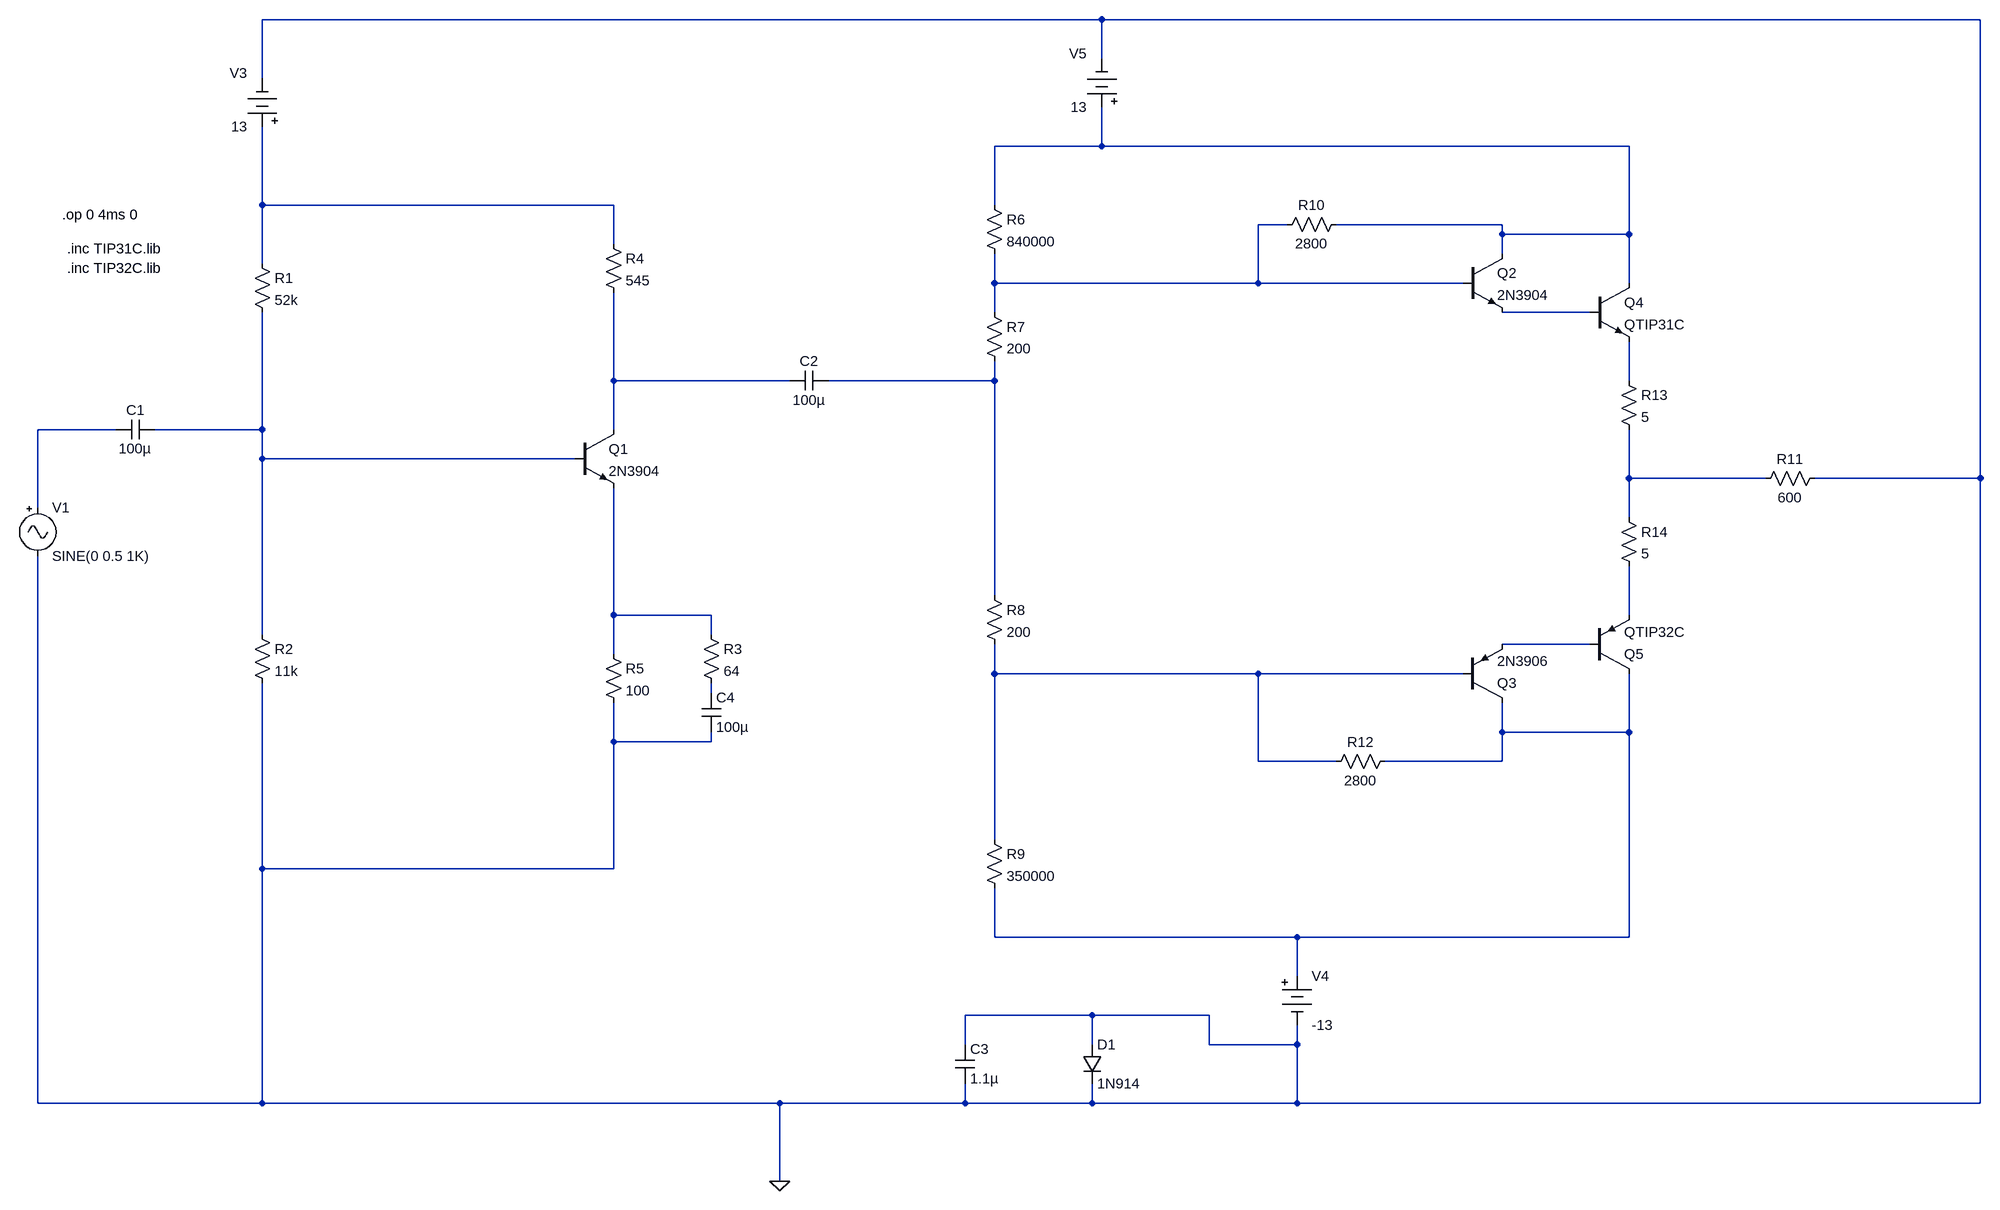
[diagram p0: schematic Scematic_v5_darlington.asc]
Scematic_v5_darlington.asc, the LTspice schematic file:
Version 4
SHEET 1 3092 1264
WIRE 1344 -656 -32 -656
WIRE 2784 -656 1344 -656
WIRE 1344 -592 1344 -656
WIRE -32 -560 -32 -656
WIRE 1344 -448 1344 -512
WIRE 1344 -448 1168 -448
WIRE 2208 -448 1344 -448
WIRE -32 -352 -32 -480
WIRE 544 -352 -32 -352
WIRE 1168 -352 1168 -448
WIRE 1648 -320 1600 -320
WIRE 2000 -320 1728 -320
WIRE 2000 -304 2000 -320
WIRE 2208 -304 2208 -448
WIRE 2208 -304 2000 -304
WIRE 544 -288 544 -352
WIRE 2000 -272 2000 -304
WIRE -32 -256 -32 -352
WIRE 1168 -224 1168 -272
WIRE 1600 -224 1600 -320
WIRE 1600 -224 1168 -224
WIRE 1936 -224 1600 -224
WIRE 2208 -224 2208 -304
WIRE 1168 -176 1168 -224
WIRE 2144 -176 2000 -176
WIRE 544 -128 544 -208
WIRE 544 -64 544 -128
WIRE 704 -64 544 -64
WIRE 832 -64 704 -64
WIRE 1168 -64 1168 -96
WIRE 1168 -64 896 -64
WIRE 2208 -64 2208 -128
WIRE -272 16 -400 16
WIRE -32 16 -32 -176
WIRE -32 16 -208 16
WIRE 544 16 544 -64
WIRE -32 64 -32 16
WIRE 128 64 -32 64
WIRE 480 64 128 64
WIRE 2208 96 2208 16
WIRE 2352 96 2208 96
WIRE 2432 96 2352 96
WIRE 2784 96 2784 -656
WIRE 2784 96 2512 96
WIRE -400 144 -400 16
WIRE 2208 160 2208 96
WIRE 544 208 544 112
WIRE 1168 288 1168 -64
WIRE 544 320 544 208
WIRE 704 320 544 320
WIRE 2208 320 2208 240
WIRE -32 352 -32 64
WIRE 704 352 704 320
WIRE 2144 368 2000 368
WIRE 544 384 544 320
WIRE 1168 416 1168 368
WIRE 1600 416 1168 416
WIRE 1936 416 1600 416
WIRE 704 448 704 432
WIRE 2000 512 2000 464
WIRE 2208 512 2208 416
WIRE 2208 512 2000 512
WIRE 544 528 544 464
WIRE 704 528 704 512
WIRE 704 528 544 528
WIRE 1600 560 1600 416
WIRE 1728 560 1600 560
WIRE 2000 560 2000 512
WIRE 2000 560 1808 560
WIRE 1168 688 1168 416
WIRE -32 736 -32 432
WIRE 544 736 544 528
WIRE 544 736 -32 736
WIRE 1168 848 1168 768
WIRE 1664 848 1168 848
WIRE 2208 848 2208 512
WIRE 2208 848 1664 848
WIRE 1664 912 1664 848
WIRE 1328 976 1120 976
WIRE 1520 976 1328 976
WIRE 1120 1024 1120 976
WIRE 1328 1024 1328 976
WIRE 1520 1024 1520 976
WIRE 1664 1024 1664 992
WIRE 1664 1024 1520 1024
WIRE -400 1120 -400 224
WIRE -32 1120 -32 736
WIRE -32 1120 -400 1120
WIRE 816 1120 -32 1120
WIRE 1120 1120 1120 1088
WIRE 1120 1120 816 1120
WIRE 1328 1120 1328 1088
WIRE 1328 1120 1120 1120
WIRE 1664 1120 1664 1024
WIRE 1664 1120 1328 1120
WIRE 2784 1120 2784 96
WIRE 2784 1120 1664 1120
WIRE 816 1248 816 1120
FLAG 816 1248 0
DATAFLAG 2352 96 "$"
DATAFLAG 704 -64 "$"
DATAFLAG 128 64 "$"
DATAFLAG 544 -128 "$"
DATAFLAG 544 208 "$"
SYMBOL npn 480 16 R0
SYMATTR InstName Q1
SYMATTR Value 2N3904
SYMBOL Misc/signal -400 128 R0
SYMATTR InstName V1
SYMATTR Value SINE(0 0.5 1K)
SYMBOL res -48 -272 R0
SYMATTR InstName R1
SYMATTR Value 52k
SYMBOL res -48 336 R0
SYMATTR InstName R2
SYMATTR Value 11k
SYMBOL res 528 -304 R0
SYMATTR InstName R4
SYMATTR Value 545
SYMBOL res 528 368 R0
SYMATTR InstName R5
SYMATTR Value 100
SYMBOL cap 832 -48 R270
WINDOW 0 32 32 VTop 2
WINDOW 3 0 32 VBottom 2
SYMATTR InstName C2
SYMATTR Value 100µ
SYMBOL res 1152 -368 R0
SYMATTR InstName R6
SYMATTR Value 840000
SYMBOL res 1152 -192 R0
SYMATTR InstName R7
SYMATTR Value 200
SYMBOL res 1152 272 R0
SYMATTR InstName R8
SYMATTR Value 200
SYMBOL res 1152 672 R0
SYMATTR InstName R9
SYMATTR Value 350000
SYMBOL res 1744 -336 R90
WINDOW 0 0 56 VBottom 2
WINDOW 3 32 56 VTop 2
SYMATTR InstName R10
SYMATTR Value 2800
SYMBOL res 1824 544 R90
WINDOW 0 0 56 VBottom 2
WINDOW 3 32 56 VTop 2
SYMATTR InstName R12
SYMATTR Value 2800
SYMBOL res 2192 -80 R0
SYMATTR InstName R13
SYMATTR Value 5
SYMBOL res 2192 144 R0
SYMATTR InstName R14
SYMATTR Value 5
SYMBOL res 2528 80 R90
WINDOW 0 0 56 VBottom 2
WINDOW 3 32 56 VTop 2
SYMATTR InstName R11
SYMATTR Value 600
SYMBOL Misc/battery 1664 896 R0
SYMATTR InstName V4
SYMATTR Value -13
SYMBOL diode 1312 1024 R0
SYMATTR InstName D1
SYMATTR Value 1N914
SYMBOL cap 1104 1024 R0
SYMATTR InstName C3
SYMATTR Value 1.1µ
SYMBOL cap -208 0 R90
WINDOW 0 0 32 VBottom 2
WINDOW 3 32 32 VTop 2
SYMATTR InstName C1
SYMATTR Value 100µ
SYMBOL Misc/battery -32 -464 R180
WINDOW 0 24 104 Left 2
WINDOW 3 24 16 Left 2
SYMATTR InstName V3
SYMATTR Value 13
SYMBOL Misc/battery 1344 -496 R180
WINDOW 0 24 104 Left 2
WINDOW 3 24 16 Left 2
SYMATTR InstName V5
SYMATTR Value 13
SYMBOL cap 688 448 R0
SYMATTR InstName C4
SYMATTR Value 100µ
SYMBOL res 688 336 R0
SYMATTR InstName R3
SYMATTR Value 64
SYMBOL npn 2144 -224 R0
SYMATTR InstName Q4
SYMATTR Value QTIP31C
SYMBOL pnp 2144 416 M180
SYMATTR InstName Q5
SYMATTR Value QTIP32C
SYMBOL npn 1936 -272 R0
SYMATTR InstName Q2
SYMATTR Value 2N3904
SYMBOL pnp 1936 464 M180
SYMATTR InstName Q3
SYMATTR Value 2N3906
TEXT -360 -336 Left 2 !.op 0 4ms 0
TEXT -352 -280 Left 2 !.inc TIP31C.lib
TEXT -352 -248 Left 2 !.inc TIP32C.lib

The netlist it stands for:
* Scematic_v5_darlington.asc
Q1 N005 N009 N011 0 2N3904
V1 N008 0 SINE(0 0.5 1K)
R1 N002 N009 52k
R2 N009 0 11k
R4 N002 N005 545
R5 N011 0 100
C2 N005 N006 100µ
R6 N001 N003 840000
R7 N003 N006 200
R8 N006 N014 200
R9 N014 N016 350000
R10 N001 N003 2800
R12 N016 N014 2800
R13 N007 N010 5
R14 N010 N012 5
R11 0 N010 600
V4 N016 0 -13
D1 0 0 1N914
C3 0 0 1.1µ
C1 N009 N008 100µ
V3 N002 0 13
V5 N001 0 13
C4 N015 0 100µ
R3 N011 N015 64
Q4 N001 N004 N007 0 QTIP31C
Q5 N016 N013 N012 0 QTIP32C
Q2 N001 N003 N004 0 2N3904
Q3 N016 N014 N013 0 2N3906
.model D D
.lib standard.dio
.model NPN NPN
.model PNP PNP
.lib standard.bjt
.op 0 4ms 0
.inc TIP31C.lib
.inc TIP32C.lib
.backanno
.end